# Altium project Lancelot_prj.PrjPCB (part 2 of 2)

## Sheet FPGA1_PWR.SchDoc
size A4
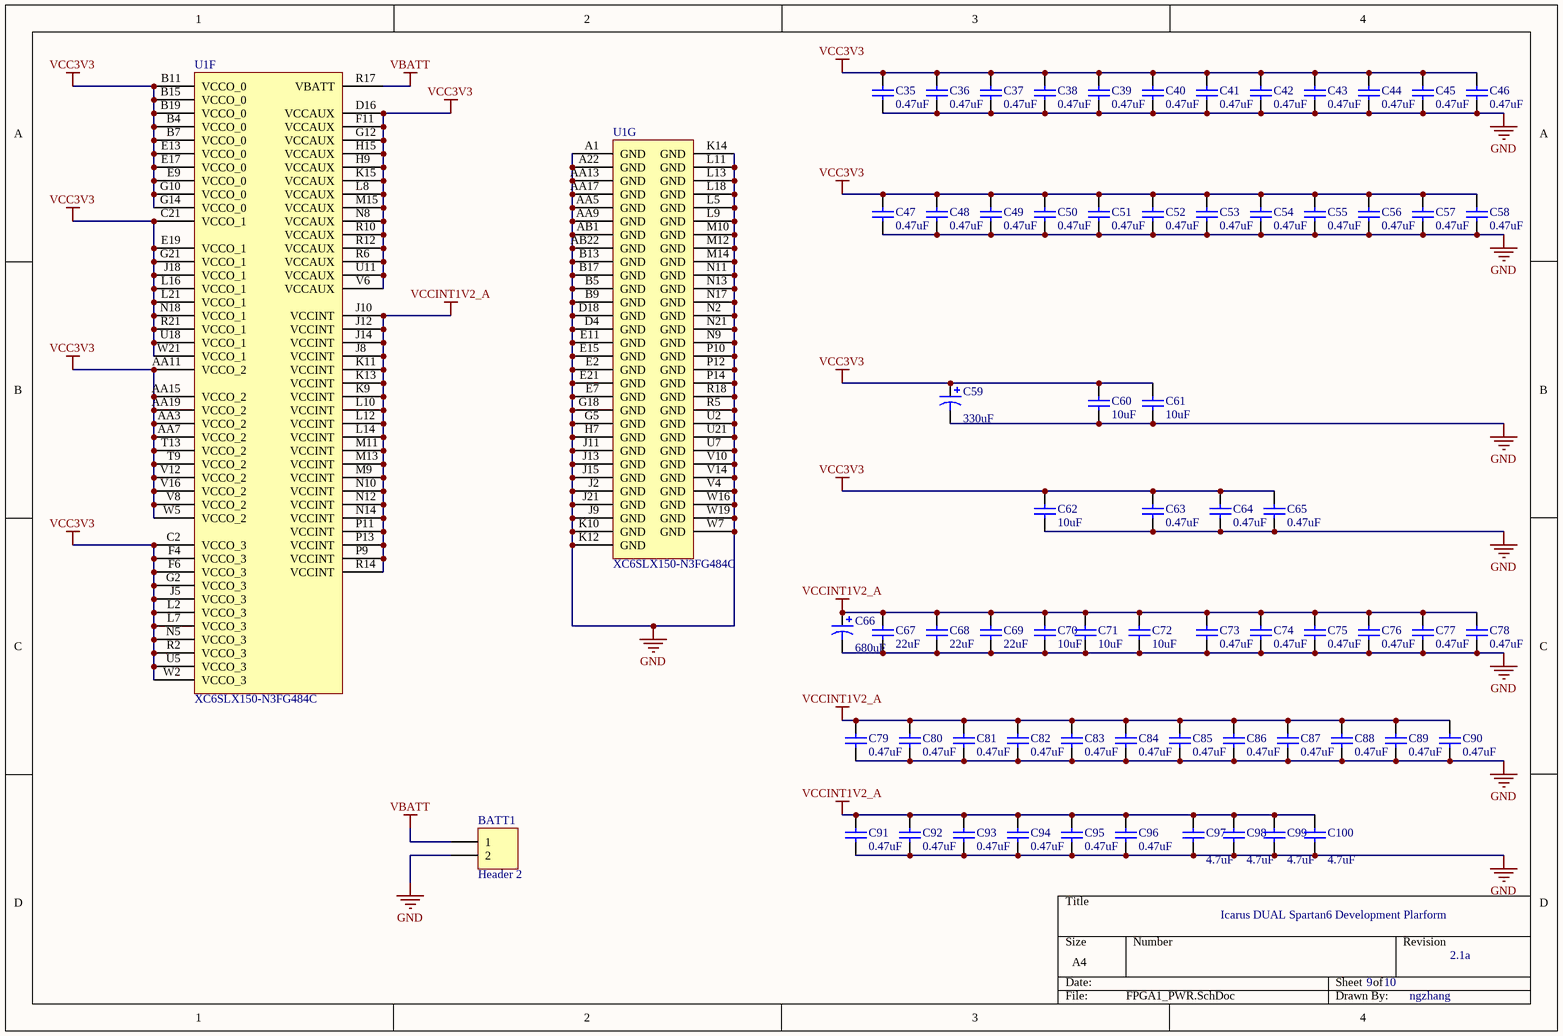
[diagram p8: FPGA1_PWR.SchDoc]

### Parts
BATT1  Header 2  [HDR1X2]
C35  0.47uF  [BGA0402]
C36  0.47uF  [BGA0402]
C37  0.47uF  [BGA0402]
C38  0.47uF  [BGA0402]
C39  0.47uF  [BGA0402]
C40  0.47uF  [BGA0402]
C41  0.47uF  [BGA0402]
C42  0.47uF  [BGA0402]
C43  0.47uF  [BGA0402]
C44  0.47uF  [BGA0402]
C45  0.47uF  [BGA0402]
C46  0.47uF  [BGA0402]
C47  0.47uF  [BGA0402]
C48  0.47uF  [BGA0402]
C49  0.47uF  [BGA0402]
C50  0.47uF  [BGA0402]
C51  0.47uF  [BGA0402]
C52  0.47uF  [BGA0402]
C53  0.47uF  [BGA0402]
C54  0.47uF  [BGA0402]
C55  0.47uF  [BGA0402]
C56  0.47uF  [BGA0402]
C57  0.47uF  [BGA0402]
C58  0.47uF  [BGA0402]
C59  330uF  [D]
C60  10uF  [CAPC2012N]
C61  10uF  [CAPC2012N]
C62  10uF  [CAPC2012N]
C63  0.47uF  [BGA0402]
C64  0.47uF  [BGA0402]
C65  0.47uF  [BGA0402]
C66  680uF  [D]
C67  22uF  [CAPC3216N]
C68  22uF  [CAPC3216N]
C69  22uF  [CAPC3216N]
C70  10uF  [CAPC2012N]
C71  10uF  [CAPC2012N]
C72  10uF  [CAPC2012N]
C73  0.47uF  [BGA0402]
C74  0.47uF  [BGA0402]
C75  0.47uF  [BGA0402]
C76  0.47uF  [BGA0402]
C77  0.47uF  [BGA0402]
C78  0.47uF  [BGA0402]
C79  0.47uF  [BGA0402]
C80  0.47uF  [BGA0402]
C81  0.47uF  [BGA0402]
C82  0.47uF  [BGA0402]
C83  0.47uF  [BGA0402]
C84  0.47uF  [BGA0402]
C85  0.47uF  [BGA0402]
C86  0.47uF  [BGA0402]
C87  0.47uF  [BGA0402]
C88  0.47uF  [BGA0402]
C89  0.47uF  [BGA0402]
C90  0.47uF  [BGA0402]
C91  0.47uF  [BGA0402]
C92  0.47uF  [BGA0402]
C93  0.47uF  [BGA0402]
C94  0.47uF  [BGA0402]
C95  0.47uF  [BGA0402]
C96  0.47uF  [BGA0402]
C97  4.7uF  [CAPC1608N]
C98  4.7uF  [CAPC1608N]
C99  4.7uF  [CAPC1608N]
C100  4.7uF  [CAPC1608N]
U1  XC6SLX150-N3FG484C  [FG484]  (parts F,G of 7)

### Nets
GND: BATT1.2 C35.1 C36.1 C37.1 C38.1 C39.1 C40.1 C41.1 C42.1 C43.1 C44.1 C45.1 C46.1 C47.1 C48.1 C49.1 C50.1 C51.1 C52.1 C53.1 C54.1 C55.1 C56.1 C57.1 C58.1 C59.2 C60.1 C61.1 C62.1 C63.1 C64.1 C65.1 C66.2 C67.1 C68.1 C69.1 C70.1 C71.1 C72.1 C73.1 C74.1 C75.1 C76.1 C77.1 C78.1 C79.1 C80.1 C81.1 C82.1 C83.1 C84.1 C85.1 C86.1 C87.1 C88.1 C89.1 C90.1 C91.1 C92.1 C93.1 C94.1 C95.1 C96.1 C97.1 C98.1 C99.1 C100.1 U1.A1(GND) U1.A22(GND) U1.AA5(GND) U1.AA9(GND) U1.AA13(GND) U1.AA17(GND) U1.AB1(GND) U1.AB22(GND) U1.B5(GND) U1.B9(GND) U1.B13(GND) U1.B17(GND) U1.D4(GND) U1.D18(GND) U1.E2(GND) U1.E7(GND) U1.E11(GND) U1.E15(GND) U1.E21(GND) U1.G5(GND) U1.G18(GND) U1.H7(GND) U1.J2(GND) U1.J9(GND) U1.J11(GND) U1.J13(GND) U1.J15(GND) U1.J21(GND) U1.K10(GND) U1.K12(GND) U1.K14(GND) U1.L5(GND) U1.L9(GND) U1.L11(GND) U1.L13(GND) U1.L18(GND) U1.M10(GND) U1.M12(GND) U1.M14(GND) U1.N2(GND) U1.N9(GND) U1.N11(GND) U1.N13(GND) U1.N17(GND) U1.N21(GND) U1.P10(GND) U1.P12(GND) U1.P14(GND) U1.R5(GND) U1.R18(GND) U1.U2(GND) U1.U7(GND) U1.U21(GND) U1.V4(GND) U1.V10(GND) U1.V14(GND) U1.W7(GND) U1.W16(GND) U1.W19(GND)
VBATT: BATT1.1 U1.R17(VBATT)
VCC3V3: C35.2 C36.2 C37.2 C38.2 C39.2 C40.2 C41.2 C42.2 C43.2 C44.2 C45.2 C46.2 C47.2 C48.2 C49.2 C50.2 C51.2 C52.2 C53.2 C54.2 C55.2 C56.2 C57.2 C58.2 C59.1 C60.2 C61.2 C62.2 C63.2 C64.2 C65.2 U1.AA3(VCCO_2) U1.AA7(VCCO_2) U1.AA11(VCCO_2) U1.AA15(VCCO_2) U1.AA19(VCCO_2) U1.B4(VCCO_0) U1.B7(VCCO_0) U1.B11(VCCO_0) U1.B15(VCCO_0) U1.B19(VCCO_0) U1.C2(VCCO_3) U1.C21(VCCO_1) U1.D16(VCCAUX) U1.E9(VCCO_0) U1.E13(VCCO_0) U1.E17(VCCO_0) U1.E19(VCCO_1) U1.F4(VCCO_3) U1.F6(VCCO_3) U1.F11(VCCAUX) U1.G2(VCCO_3) U1.G10(VCCO_0) U1.G12(VCCAUX) U1.G14(VCCO_0) U1.G21(VCCO_1) U1.H9(VCCAUX) U1.H15(VCCAUX) U1.J5(VCCO_3) U1.J18(VCCO_1) U1.K15(VCCAUX) U1.L2(VCCO_3) U1.L7(VCCO_3) U1.L8(VCCAUX) U1.L16(VCCO_1) U1.L21(VCCO_1) U1.M15(VCCAUX) U1.N5(VCCO_3) U1.N8(VCCAUX) U1.N18(VCCO_1) U1.R2(VCCO_3) U1.R6(VCCAUX) U1.R10(VCCAUX) U1.R12(VCCAUX) U1.R21(VCCO_1) U1.T9(VCCO_2) U1.T13(VCCO_2) U1.U5(VCCO_3) U1.U11(VCCAUX) U1.U18(VCCO_1) U1.V6(VCCAUX) U1.V8(VCCO_2) U1.V12(VCCO_2) U1.V16(VCCO_2) U1.W2(VCCO_3) U1.W5(VCCO_2) U1.W21(VCCO_1)
VCCINT1V2_A: C66.1 C67.2 C68.2 C69.2 C70.2 C71.2 C72.2 C73.2 C74.2 C75.2 C76.2 C77.2 C78.2 C79.2 C80.2 C81.2 C82.2 C83.2 C84.2 C85.2 C86.2 C87.2 C88.2 C89.2 C90.2 C91.2 C92.2 C93.2 C94.2 C95.2 C96.2 C97.2 C98.2 C99.2 C100.2 U1.J8(VCCINT) U1.J10(VCCINT) U1.J12(VCCINT) U1.J14(VCCINT) U1.K9(VCCINT) U1.K11(VCCINT) U1.K13(VCCINT) U1.L10(VCCINT) U1.L12(VCCINT) U1.L14(VCCINT) U1.M9(VCCINT) U1.M11(VCCINT) U1.M13(VCCINT) U1.N10(VCCINT) U1.N12(VCCINT) U1.N14(VCCINT) U1.P9(VCCINT) U1.P11(VCCINT) U1.P13(VCCINT) U1.R14(VCCINT)

### Notes on the sheet
- Icarus DUAL Spartan6 Development Plarform
- 9
- 10
- 2.1a
- ngzhang

### Library data of the parts
BATT1 = Header 2: Header, 2-Pin; LatestRevisionDate: 17-Jul-2002; LatestRevisionNote: Re-released for DXP Platform.; Publisher: Altium Limited
C35-C58 C60-C65 C67-C100 = Cap Semi: Capacitor (Semiconductor SIM Model); Published: 8-Jun-2000; LatestRevisionDate: 29-May-2009; LatestRevisionNote: IPC-7351 Footprint Added.; PackageReference: C1206; Publisher: Altium Limited; PackageDescription: Chip Capacitor
  C35-C58 C63-C65 C73-C96: Value: 0.47uF
  C60-C62 C70-C72: Value: 10uF
  C67-C69: Value: 22uF
  C97-C100: Value: 4.7uF
C59 C66 = Cap Pol3: Polarized Capacitor (Surface Mount); Published: 8-Jun-2000; LatestRevisionDate: 29-May-2009; LatestRevisionNote: IPC-7351 Footprint Added.; PackageReference: C0805; Publisher: Altium Limited; PackageDescription: Chip Capacitor
  C59: Value: 330uF
  C66: Value: 680uF
U1 = XC6SLX150-N3FG484C: Spartan-6 LX 1.2V FPGA, 338 User I/Os, 484-Ball Fine-Pitch BGA (1.0mm Pitch), Speed Grade 3N, Commercial Grade; Published: 24-Aug-2010; DatasheetVersion: ver1.6, Nov-2010; PackageVersion: ver1.1, Dec-2008; PackageReference: FG484; Publisher: Altium Limited; PackageDescription: 484-Ball Fine Pitch Ball Grid Array 1.00 mm Pitch (FG484); Code_JEDEC: MS-034-AAJ-1; Code_IPC: BGA100P22X22-484; ComponentLink1Description: Manufacturer Link; ComponentLink1URL: http://www.xilinx.com; ComponentLink2Description: Spartan-6 Datasheet; ComponentLink2URL: http://www.xilinx.com/support/documentation/data_sheets/ds160.pdf; ComponentLink3Description: Spartan-6 Documents; ComponentLink3URL: http://www.xilinx.com/support/documentation/spartan-6.htm; ComponentLink4Description: Xilinx.com Home; ComponentLink4URL: http://www.xilinx.com

## Sheet FPGA2_PWR.SchDoc
size A4
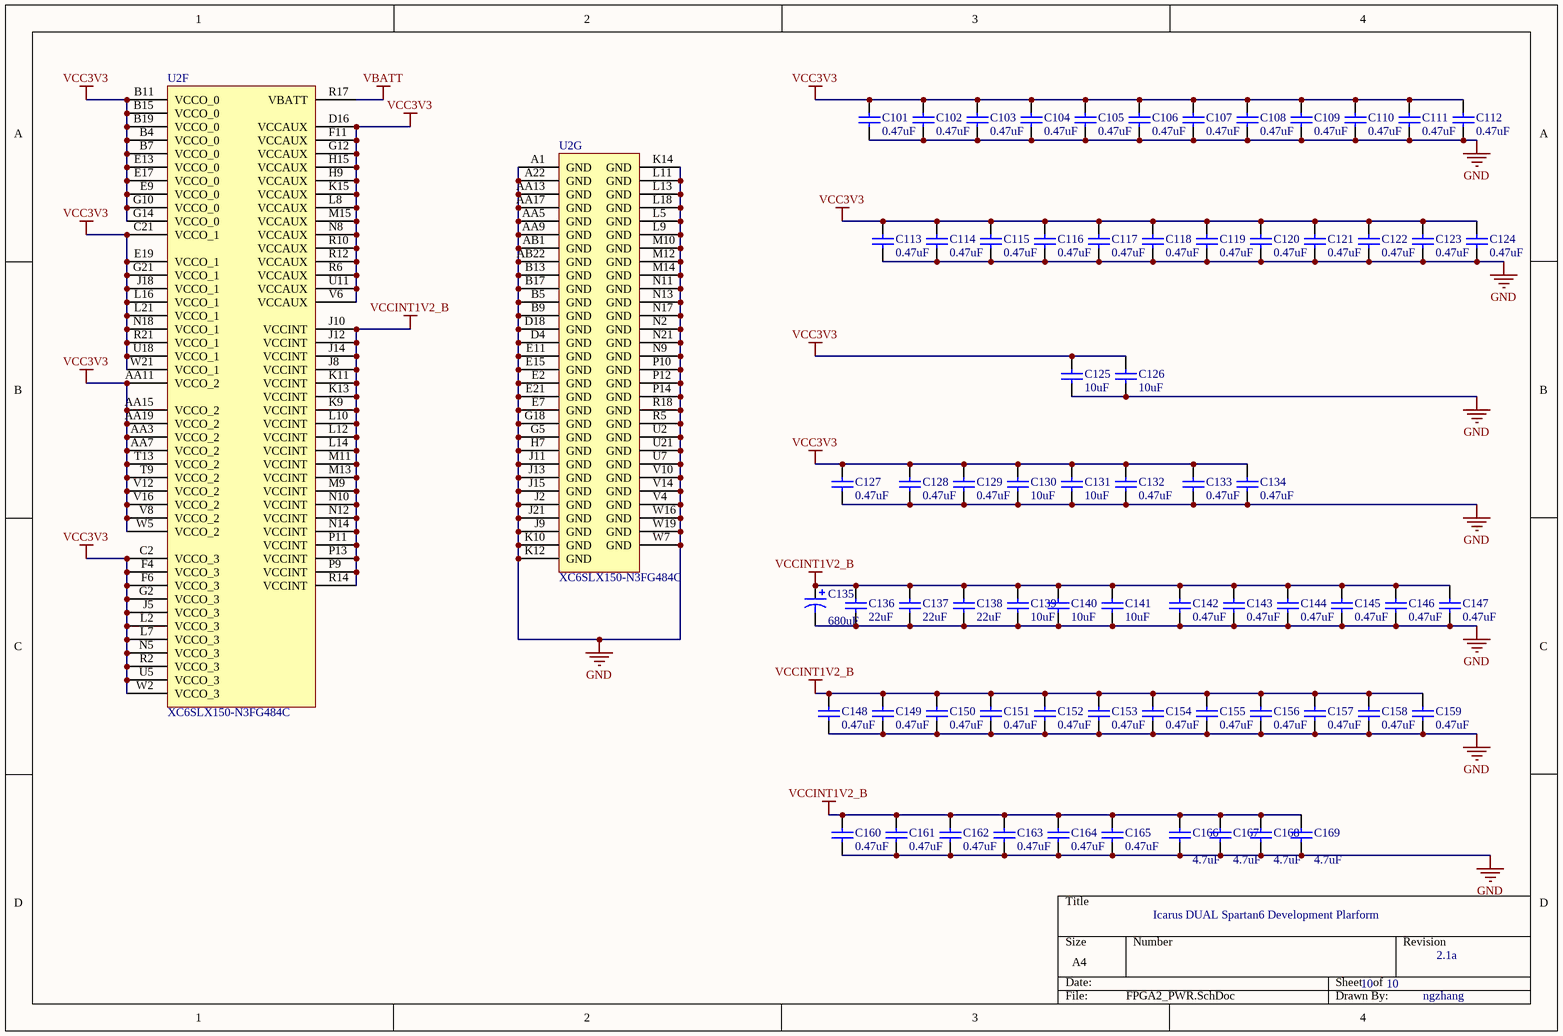
[diagram p9: FPGA2_PWR.SchDoc]

### Parts
C101  0.47uF  [BGA0402]
C102  0.47uF  [BGA0402]
C103  0.47uF  [BGA0402]
C104  0.47uF  [BGA0402]
C105  0.47uF  [BGA0402]
C106  0.47uF  [BGA0402]
C107  0.47uF  [BGA0402]
C108  0.47uF  [BGA0402]
C109  0.47uF  [BGA0402]
C110  0.47uF  [BGA0402]
C111  0.47uF  [BGA0402]
C112  0.47uF  [BGA0402]
C113  0.47uF  [BGA0402]
C114  0.47uF  [BGA0402]
C115  0.47uF  [BGA0402]
C116  0.47uF  [BGA0402]
C117  0.47uF  [BGA0402]
C118  0.47uF  [BGA0402]
C119  0.47uF  [BGA0402]
C120  0.47uF  [BGA0402]
C121  0.47uF  [BGA0402]
C122  0.47uF  [BGA0402]
C123  0.47uF  [BGA0402]
C124  0.47uF  [BGA0402]
C125  10uF  [CAPC2012N]
C126  10uF  [CAPC2012N]
C127  0.47uF  [BGA0402]
C128  0.47uF  [BGA0402]
C129  0.47uF  [BGA0402]
C130  10uF  [CAPC2012N]
C131  10uF  [CAPC2012N]
C132  0.47uF  [BGA0402]
C133  0.47uF  [BGA0402]
C134  0.47uF  [BGA0402]
C135  680uF  [D]
C136  22uF  [CAPC3216N]
C137  22uF  [CAPC3216N]
C138  22uF  [CAPC3216N]
C139  10uF  [CAPC2012N]
C140  10uF  [CAPC2012N]
C141  10uF  [CAPC2012N]
C142  0.47uF  [BGA0402]
C143  0.47uF  [BGA0402]
C144  0.47uF  [BGA0402]
C145  0.47uF  [BGA0402]
C146  0.47uF  [BGA0402]
C147  0.47uF  [BGA0402]
C148  0.47uF  [BGA0402]
C149  0.47uF  [BGA0402]
C150  0.47uF  [BGA0402]
C151  0.47uF  [BGA0402]
C152  0.47uF  [BGA0402]
C153  0.47uF  [BGA0402]
C154  0.47uF  [BGA0402]
C155  0.47uF  [BGA0402]
C156  0.47uF  [BGA0402]
C157  0.47uF  [BGA0402]
C158  0.47uF  [BGA0402]
C159  0.47uF  [BGA0402]
C160  0.47uF  [BGA0402]
C161  0.47uF  [BGA0402]
C162  0.47uF  [BGA0402]
C163  0.47uF  [BGA0402]
C164  0.47uF  [BGA0402]
C165  0.47uF  [BGA0402]
C166  4.7uF  [CAPC1608N]
C167  4.7uF  [CAPC1608N]
C168  4.7uF  [CAPC1608N]
C169  4.7uF  [CAPC1608N]
U2  XC6SLX150-N3FG484C  [FG484]  (parts F,G of 7)

### Nets
GND: C101.1 C102.1 C103.1 C104.1 C105.1 C106.1 C107.1 C108.1 C109.1 C110.1 C111.1 C112.1 C113.1 C114.1 C115.1 C116.1 C117.1 C118.1 C119.1 C120.1 C121.1 C122.1 C123.1 C124.1 C125.1 C126.1 C127.1 C128.1 C129.1 C130.1 C131.1 C132.1 C133.1 C134.1 C135.2 C136.1 C137.1 C138.1 C139.1 C140.1 C141.1 C142.1 C143.1 C144.1 C145.1 C146.1 C147.1 C148.1 C149.1 C150.1 C151.1 C152.1 C153.1 C154.1 C155.1 C156.1 C157.1 C158.1 C159.1 C160.1 C161.1 C162.1 C163.1 C164.1 C165.1 C166.1 C167.1 C168.1 C169.1 U2.A1(GND) U2.A22(GND) U2.AA5(GND) U2.AA9(GND) U2.AA13(GND) U2.AA17(GND) U2.AB1(GND) U2.AB22(GND) U2.B5(GND) U2.B9(GND) U2.B13(GND) U2.B17(GND) U2.D4(GND) U2.D18(GND) U2.E2(GND) U2.E7(GND) U2.E11(GND) U2.E15(GND) U2.E21(GND) U2.G5(GND) U2.G18(GND) U2.H7(GND) U2.J2(GND) U2.J9(GND) U2.J11(GND) U2.J13(GND) U2.J15(GND) U2.J21(GND) U2.K10(GND) U2.K12(GND) U2.K14(GND) U2.L5(GND) U2.L9(GND) U2.L11(GND) U2.L13(GND) U2.L18(GND) U2.M10(GND) U2.M12(GND) U2.M14(GND) U2.N2(GND) U2.N9(GND) U2.N11(GND) U2.N13(GND) U2.N17(GND) U2.N21(GND) U2.P10(GND) U2.P12(GND) U2.P14(GND) U2.R5(GND) U2.R18(GND) U2.U2(GND) U2.U7(GND) U2.U21(GND) U2.V4(GND) U2.V10(GND) U2.V14(GND) U2.W7(GND) U2.W16(GND) U2.W19(GND)
VBATT: U2.R17(VBATT)
VCC3V3: C101.2 C102.2 C103.2 C104.2 C105.2 C106.2 C107.2 C108.2 C109.2 C110.2 C111.2 C112.2 C113.2 C114.2 C115.2 C116.2 C117.2 C118.2 C119.2 C120.2 C121.2 C122.2 C123.2 C124.2 C125.2 C126.2 C127.2 C128.2 C129.2 C130.2 C131.2 C132.2 C133.2 C134.2 U2.AA3(VCCO_2) U2.AA7(VCCO_2) U2.AA11(VCCO_2) U2.AA15(VCCO_2) U2.AA19(VCCO_2) U2.B4(VCCO_0) U2.B7(VCCO_0) U2.B11(VCCO_0) U2.B15(VCCO_0) U2.B19(VCCO_0) U2.C2(VCCO_3) U2.C21(VCCO_1) U2.D16(VCCAUX) U2.E9(VCCO_0) U2.E13(VCCO_0) U2.E17(VCCO_0) U2.E19(VCCO_1) U2.F4(VCCO_3) U2.F6(VCCO_3) U2.F11(VCCAUX) U2.G2(VCCO_3) U2.G10(VCCO_0) U2.G12(VCCAUX) U2.G14(VCCO_0) U2.G21(VCCO_1) U2.H9(VCCAUX) U2.H15(VCCAUX) U2.J5(VCCO_3) U2.J18(VCCO_1) U2.K15(VCCAUX) U2.L2(VCCO_3) U2.L7(VCCO_3) U2.L8(VCCAUX) U2.L16(VCCO_1) U2.L21(VCCO_1) U2.M15(VCCAUX) U2.N5(VCCO_3) U2.N8(VCCAUX) U2.N18(VCCO_1) U2.R2(VCCO_3) U2.R6(VCCAUX) U2.R10(VCCAUX) U2.R12(VCCAUX) U2.R21(VCCO_1) U2.T9(VCCO_2) U2.T13(VCCO_2) U2.U5(VCCO_3) U2.U11(VCCAUX) U2.U18(VCCO_1) U2.V6(VCCAUX) U2.V8(VCCO_2) U2.V12(VCCO_2) U2.V16(VCCO_2) U2.W2(VCCO_3) U2.W5(VCCO_2) U2.W21(VCCO_1)
VCCINT1V2_B: C135.1 C136.2 C137.2 C138.2 C139.2 C140.2 C141.2 C142.2 C143.2 C144.2 C145.2 C146.2 C147.2 C148.2 C149.2 C150.2 C151.2 C152.2 C153.2 C154.2 C155.2 C156.2 C157.2 C158.2 C159.2 C160.2 C161.2 C162.2 C163.2 C164.2 C165.2 C166.2 C167.2 C168.2 C169.2 U2.J8(VCCINT) U2.J10(VCCINT) U2.J12(VCCINT) U2.J14(VCCINT) U2.K9(VCCINT) U2.K11(VCCINT) U2.K13(VCCINT) U2.L10(VCCINT) U2.L12(VCCINT) U2.L14(VCCINT) U2.M9(VCCINT) U2.M11(VCCINT) U2.M13(VCCINT) U2.N10(VCCINT) U2.N12(VCCINT) U2.N14(VCCINT) U2.P9(VCCINT) U2.P11(VCCINT) U2.P13(VCCINT) U2.R14(VCCINT)

### Notes on the sheet
- Icarus DUAL Spartan6 Development Plarform
- 10
- 2.1a
- ngzhang

### Library data of the parts
C101-C134 C136-C169 = Cap Semi: Capacitor (Semiconductor SIM Model); Published: 8-Jun-2000; LatestRevisionDate: 29-May-2009; LatestRevisionNote: IPC-7351 Footprint Added.; PackageReference: C1206; Publisher: Altium Limited; PackageDescription: Chip Capacitor
  C101-C124 C127-C129 C132-C134 C142-C165: Value: 0.47uF
  C125 C126 C130 C131 C139-C141: Value: 10uF
  C136-C138: Value: 22uF
  C166-C169: Value: 4.7uF
C135 = Cap Pol3: Polarized Capacitor (Surface Mount); Published: 8-Jun-2000; LatestRevisionDate: 29-May-2009; LatestRevisionNote: IPC-7351 Footprint Added.; PackageReference: C0805; Publisher: Altium Limited; PackageDescription: Chip Capacitor; Value: 680uF
U2 = XC6SLX150-N3FG484C: as U1 on sheet FPGA1_PWR; Published: 24-Aug-2010; DatasheetVersion: ver1.6, Nov-2010; PackageVersion: ver1.1, Dec-2008; PackageReference: FG484; Publisher: Altium Limited; PackageDescription: 484-Ball Fine Pitch Ball Grid Array 1.00 mm Pitch (FG484); Code_JEDEC: MS-034-AAJ-1; Code_IPC: BGA100P22X22-484; ComponentLink1Description: Manufacturer Link; ComponentLink1URL: http://www.xilinx.com; ComponentLink2Description: Spartan-6 Datasheet; ComponentLink2URL: http://www.xilinx.com/support/documentation/data_sheets/ds160.pdf; ComponentLink3Description: Spartan-6 Documents; ComponentLink3URL: http://www.xilinx.com/support/documentation/spartan-6.htm; ComponentLink4Description: Xilinx.com Home; ComponentLink4URL: http://www.xilinx.com

## Sheet connector.SchDoc
size A4
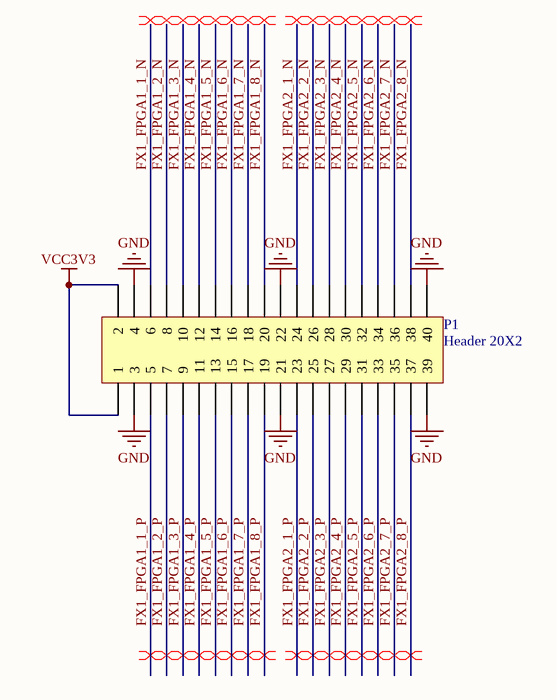
[diagram p10: connector.SchDoc]

### Parts
P1  Header 20X2  [HDR2X20]

### Nets
GND: P1.3 P1.4 P1.21 P1.22 P1.39 P1.40
VCC3V3: P1.1 P1.2
FX1_FPGA1_1_N: P1.6
FX1_FPGA1_1_P: P1.5
FX1_FPGA1_2_N: P1.8
FX1_FPGA1_2_P: P1.7
FX1_FPGA1_3_N: P1.10
FX1_FPGA1_3_P: P1.9
FX1_FPGA1_4_N: P1.12
FX1_FPGA1_4_P: P1.11
FX1_FPGA1_5_N: P1.14
FX1_FPGA1_5_P: P1.13
FX1_FPGA1_6_N: P1.16
FX1_FPGA1_6_P: P1.15
FX1_FPGA1_7_N: P1.18
FX1_FPGA1_7_P: P1.17
FX1_FPGA1_8_N: P1.20
FX1_FPGA1_8_P: P1.19
FX1_FPGA2_1_N: P1.24
FX1_FPGA2_1_P: P1.23
FX1_FPGA2_2_N: P1.26
FX1_FPGA2_2_P: P1.25
FX1_FPGA2_3_N: P1.28
FX1_FPGA2_3_P: P1.27
FX1_FPGA2_4_N: P1.30
FX1_FPGA2_4_P: P1.29
FX1_FPGA2_5_N: P1.32
FX1_FPGA2_5_P: P1.31
FX1_FPGA2_6_N: P1.34
FX1_FPGA2_6_P: P1.33
FX1_FPGA2_7_N: P1.36
FX1_FPGA2_7_P: P1.35
FX1_FPGA2_8_N: P1.38
FX1_FPGA2_8_P: P1.37

### Layout directives
differential pair: FX1_FPGA1_1_N, FX1_FPGA1_1_P, FX1_FPGA1_2_N, FX1_FPGA1_2_P, FX1_FPGA1_3_N, FX1_FPGA1_3_P, FX1_FPGA1_4_N, FX1_FPGA1_4_P, FX1_FPGA1_5_N, FX1_FPGA1_5_P, FX1_FPGA1_6_N, FX1_FPGA1_6_P, FX1_FPGA1_7_N, FX1_FPGA1_7_P, FX1_FPGA1_8_N, FX1_FPGA1_8_P, FX1_FPGA2_1_N, FX1_FPGA2_1_P, FX1_FPGA2_2_N, FX1_FPGA2_2_P, FX1_FPGA2_3_N, FX1_FPGA2_3_P, FX1_FPGA2_4_N, FX1_FPGA2_4_P, FX1_FPGA2_5_N, FX1_FPGA2_5_P, FX1_FPGA2_6_N, FX1_FPGA2_6_P, FX1_FPGA2_7_N, FX1_FPGA2_7_P, FX1_FPGA2_8_N, FX1_FPGA2_8_P

### Library data of the parts
P1 = Header 20X2: Header, 20-Pin, Dual row; LatestRevisionDate: 17-Jul-2002; LatestRevisionNote: Re-released for DXP Platform.; Publisher: Altium Limited

## Nets that join several sheets
GND: core_power (40 pins), io_power (16 pins), clock (7 pins), USB_UART (13 pins), peripherals (32 pins), config (42 pins), FPGA1 (231 pins), FPGA2 (231 pins), FPGA1_PWR (126 pins), FPGA2_PWR (128 pins), connector (6 pins)
VBATT: FPGA1_PWR (BATT1.1 U1.R17), FPGA2_PWR (U2.R17)
VCC3V3: io_power (7 pins), clock (6 pins), USB_UART (R96.2), peripherals (21 pins), config (25 pins), FPGA2 (RN4.1 RN4.2 RN4.3 RN4.4), FPGA1_PWR (87 pins), FPGA2_PWR (90 pins), connector (P1.1 P1.2)
VCC12V: core_power (8 pins), io_power (C170.2 FB5.2), peripherals (Q6.3 R67.1)
VCCINT1V2_A: core_power (8 pins), FPGA1_PWR (55 pins)
VCCINT1V2_B: core_power (8 pins), FPGA2_PWR (55 pins)
FAN_PWM: peripherals (R77.2), FPGA2 (U2.B20)
FAN_SPEED: peripherals (R78.1), FPGA2 (U2.C20)
FPGA1_B1_1_N: FPGA1 (U1.B22), FPGA2 (U2.B1)
FPGA1_B1_1_P: FPGA1 (U1.B21), FPGA2 (U2.B2)
FPGA1_B1_2_N: FPGA1 (U1.A21), FPGA2 (U2.B3)
FPGA1_B1_2_P: FPGA1 (U1.A20), FPGA2 (U2.A2)
FPGA1_B1_3_N: FPGA1 (U1.D22), FPGA2 (U2.D1)
FPGA1_B1_3_P: FPGA1 (U1.D21), FPGA2 (U2.D2)
FPGA1_B1_4_N: FPGA1 (U1.F22), FPGA2 (U2.F1)
FPGA1_B1_4_P: FPGA1 (U1.F21), FPGA2 (U2.F2)
FPGA1_B1_5_N: FPGA1 (U1.H22), FPGA2 (U2.K4)
FPGA1_B1_5_P: FPGA1 (U1.H21), FPGA2 (U2.K5)
FPGA1_B1_6_N: FPGA1 (U1.K22), FPGA2 (U2.K1)
FPGA1_B1_6_P: FPGA1 (U1.K21), FPGA2 (U2.K2)
FPGA1_B1_7_N: FPGA1 (U1.L22), FPGA2 (U2.M1)
FPGA1_B1_7_P: FPGA1 (U1.L20), FPGA2 (U2.M2)
FPGA1_B1_8_N: FPGA1 (U1.M22), FPGA2 (U2.P1)
FPGA1_B1_8_P: FPGA1 (U1.M21), FPGA2 (U2.P2)
FPGA1_B1_9_N: FPGA1 (U1.P22), FPGA2 (U2.T1)
FPGA1_B1_9_P: FPGA1 (U1.P21), FPGA2 (U2.T2)
FPGA1_B1_10_N: FPGA1 (U1.T22), FPGA2 (U2.V1)
FPGA1_B1_10_P: FPGA1 (U1.T21), FPGA2 (U2.V2)
FPGA1_B1_11_N: FPGA1 (U1.V22), FPGA2 (U2.W1)
FPGA1_B1_11_P: FPGA1 (U1.V21), FPGA2 (U2.W3)
FPGA1_B1_12_N: FPGA1 (U1.W22), FPGA2 (U2.Y1)
FPGA1_B1_12_P: FPGA1 (U1.W20), FPGA2 (U2.Y2)
FPGA1_BUSY: config (FX1.26), FPGA1 (U1.T20)
FPGA1_CLK: clock (R4.1), FPGA1 (U1.J1)
FPGA1_CS: config (R21.2), FPGA1 (U1.T5)
FPGA1_DQ0: config (FX1.79 RN2.8), FPGA1 (U1.AA20)
FPGA1_DQ1: config (FX1.77 RN2.7), FPGA1 (U1.U14)
FPGA1_DQ2: config (FX1.73 RN2.5), FPGA1 (U1.U13)
FPGA1_DQ3: config (FX1.35), FPGA1 (U1.AA6)
FPGA1_DQ4: config (FX1.32), FPGA1 (U1.AB6)
FPGA1_DQ5: config (FX1.36), FPGA1 (U1.W4)
FPGA1_DQ6: config (FX1.37), FPGA1 (U1.Y4)
FPGA1_DQ7: config (FX1.30), FPGA1 (U1.Y7)
FPGA1_DQ8: config (FX1.39), FPGA1 (U1.AA2)
FPGA1_DQ9: config (FX1.38), FPGA1 (U1.AB2)
FPGA1_DQ10: config (FX1.27), FPGA1 (U1.V15)
FPGA1_DQ11: config (FX1.25), FPGA1 (U1.AA18)
FPGA1_DQ12: config (FX1.24), FPGA1 (U1.AB18)
FPGA1_DQ13: config (FX1.29), FPGA1 (U1.Y13)
FPGA1_DQ14: config (FX1.31), FPGA1 (U1.AA12)
FPGA1_DQ15: config (FX1.28), FPGA1 (U1.AB12)
FPGA1_HSWAP: config (R13.2), FPGA1 (U1.A3)
FPGA1_INIT: config (FX1.34 R15.2 TP1.1), FPGA1 (U1.T6)
FPGA1_LED1: peripherals (RN8.5), FPGA1 (U1.A16)
FPGA1_LED2: peripherals (RN8.6), FPGA1 (U1.A17)
FPGA1_LED3: peripherals (RN8.7), FPGA1 (U1.B18)
FPGA1_LED4: peripherals (RN8.8), FPGA1 (U1.A18)
FPGA1_M0: config (R5.2 R6.2), FPGA1 (U1.AA22)
FPGA1_M1: config (R7.2 R8.2), FPGA1 (U1.U15)
FPGA1_RDWR_B: config (FX1.33), FPGA1 (U1.AB7)
FPGA1_SCK: config (FX1.22 R28.2 R30.1 U4.6), FPGA1 (U1.Y21)
FPGA1_SDI: config (FX1.75 RN2.6), FPGA1 (U1.AB20)
FPGA1_SW1: peripherals (R86.1 RST_1.1), FPGA1 (U1.A4)
FPGA1_SW2: peripherals (R84.1 R85.2), FPGA1 (U1.D6)
FPGA1_SW3: peripherals (RN6.8 S2.1), FPGA1 (U1.C6)
FPGA1_SW4: peripherals (RN6.7 S2.2), FPGA1 (U1.C8)
FPGA1_SW5: peripherals (RN6.6 S2.3), FPGA1 (U1.A10)
FPGA1_SW6: peripherals (RN6.5 S2.4), FPGA1 (U1.B10)
FPGA1_SW7: peripherals (R82.1 SET_1.1), FPGA1 (U1.C10)
FPGA2_BUSY: config (FX1.6), FPGA2 (U2.T20)
FPGA2_CLK: clock (R3.1), FPGA2 (U2.J1)
FPGA2_CS: config (R25.2), FPGA2 (U2.T5)
FPGA2_DQ0: config (FX1.47 RN3.8), FPGA2 (U2.AA20)
FPGA2_DQ1: config (FX1.45 RN3.7), FPGA2 (U2.U14)
FPGA2_DQ2: config (FX1.41 RN3.5), FPGA2 (U2.U13)
FPGA2_DQ3: config (FX1.13), FPGA2 (U2.AA6)
FPGA2_DQ4: config (FX1.12), FPGA2 (U2.AB6)
FPGA2_DQ5: config (FX1.16), FPGA2 (U2.W4)
FPGA2_DQ6: config (FX1.15), FPGA2 (U2.Y4)
FPGA2_DQ7: config (FX1.10), FPGA2 (U2.Y7)
FPGA2_DQ8: config (FX1.17), FPGA2 (U2.AA2)
FPGA2_DQ9: config (FX1.18), FPGA2 (U2.AB2)
FPGA2_DQ10: config (FX1.5), FPGA2 (U2.V15)
FPGA2_DQ11: config (FX1.3), FPGA2 (U2.AA18)
FPGA2_DQ12: config (FX1.4), FPGA2 (U2.AB18)
FPGA2_DQ13: config (FX1.7), FPGA2 (U2.Y13)
FPGA2_DQ14: config (FX1.9), FPGA2 (U2.AA12)
FPGA2_DQ15: config (FX1.8), FPGA2 (U2.AB12)
FPGA2_HSWAP: config (R17.2), FPGA2 (U2.A3)
FPGA2_INIT: config (FX1.14 R16.2 TP2.1), FPGA2 (U2.T6)
FPGA2_LED1: peripherals (RN10.5), FPGA2 (U2.A16)
FPGA2_LED2: peripherals (RN10.6), FPGA2 (U2.A17)
FPGA2_LED3: peripherals (RN10.7), FPGA2 (U2.B18)
FPGA2_LED4: peripherals (RN10.8), FPGA2 (U2.A18)
FPGA2_M0: config (R9.2 R10.2), FPGA2 (U2.AA22)
FPGA2_M1: config (R11.2 R12.2), FPGA2 (U2.U15)
FPGA2_RDWR_B: config (FX1.11), FPGA2 (U2.AB7)
FPGA2_SCK: config (FX1.2 R32.2 R35.1 U5.6), FPGA2 (U2.Y21)
FPGA2_SDI: config (FX1.43 RN3.6), FPGA2 (U2.AB20)
FPGA2_SW1: peripherals (R92.1 RST_2.1), FPGA2 (U2.A4)
FPGA2_SW2: peripherals (R88.1 R89.2), FPGA2 (U2.D6)
FPGA2_SW3: peripherals (RN9.8 S3.1), FPGA2 (U2.C6)
FPGA2_SW4: peripherals (RN9.7 S3.2), FPGA2 (U2.C8)
FPGA2_SW5: peripherals (RN9.6 S3.3), FPGA2 (U2.A10)
FPGA2_SW6: peripherals (RN9.5 S3.4), FPGA2 (U2.B10)
FPGA2_SW7: peripherals (R90.1 SET_2.1), FPGA2 (U2.C10)
FX1_FPGA1_1_N: FPGA1 (U1.A5), connector (P1.6)
FX1_FPGA1_1_P: FPGA1 (U1.C5), connector (P1.5)
FX1_FPGA1_2_N: FPGA1 (U1.A6), connector (P1.8)
FX1_FPGA1_2_P: FPGA1 (U1.B6), connector (P1.7)
FX1_FPGA1_3_N: FPGA1 (U1.A7), connector (P1.10)
FX1_FPGA1_3_P: FPGA1 (U1.C7), connector (P1.9)
FX1_FPGA1_4_N: FPGA1 (U1.A8), connector (P1.12)
FX1_FPGA1_4_P: FPGA1 (U1.B8), connector (P1.11)
FX1_FPGA1_5_N: FPGA1 (U1.A9), connector (P1.14)
FX1_FPGA1_5_P: FPGA1 (U1.C9), connector (P1.13)
FX1_FPGA1_6_N: FPGA1 (U1.A11), connector (P1.16)
FX1_FPGA1_6_P: FPGA1 (U1.C11), connector (P1.15)
FX1_FPGA1_7_N: FPGA1 (U1.A12), connector (P1.18)
FX1_FPGA1_7_P: FPGA1 (U1.B12), connector (P1.17)
FX1_FPGA1_8_N: FPGA1 (U1.A13), connector (P1.20)
FX1_FPGA1_8_P: FPGA1 (U1.C13), connector (P1.19)
FX1_FPGA2_1_N: FPGA2 (U2.A5), connector (P1.24)
FX1_FPGA2_1_P: FPGA2 (U2.C5), connector (P1.23)
FX1_FPGA2_2_N: FPGA2 (U2.A6), connector (P1.26)
FX1_FPGA2_2_P: FPGA2 (U2.B6), connector (P1.25)
FX1_FPGA2_3_N: FPGA2 (U2.A7), connector (P1.28)
FX1_FPGA2_3_P: FPGA2 (U2.C7), connector (P1.27)
FX1_FPGA2_4_N: FPGA2 (U2.A8), connector (P1.30)
FX1_FPGA2_4_P: FPGA2 (U2.B8), connector (P1.29)
FX1_FPGA2_5_N: FPGA2 (U2.A9), connector (P1.32)
FX1_FPGA2_5_P: FPGA2 (U2.C9), connector (P1.31)
FX1_FPGA2_6_N: FPGA2 (U2.A11), connector (P1.34)
FX1_FPGA2_6_P: FPGA2 (U2.C11), connector (P1.33)
FX1_FPGA2_7_N: FPGA2 (U2.A12), connector (P1.36)
FX1_FPGA2_7_P: FPGA2 (U2.B12), connector (P1.35)
FX1_FPGA2_8_N: FPGA2 (U2.A13), connector (P1.38)
FX1_FPGA2_8_P: FPGA2 (U2.C13), connector (P1.37)
TMP_ALERT: peripherals (R80.1 U9.3), FPGA2 (U2.C3)
TMP_SCL: peripherals (R69.1 U9.1), FPGA2 (U2.C1)
TMP_SDA: peripherals (R70.1 U9.6), FPGA2 (U2.E1)
UART_CTS: USB_UART (RN11.4), FPGA1 (U1.B2)
UART_RTS: USB_UART (RN11.2), FPGA1 (U1.D2)
UART_RXD: USB_UART (RN11.3), FPGA1 (U1.B1)
UART_TXD: USB_UART (RN11.1), FPGA1 (U1.D1)
VCC_IN: core_power (5 pins), config (15 pins)
VCCINT1_PG: core_power (R43.1 TP3.1 U6.5), io_power (R63.1)